# EAGLE design placa_teste_av (EAGLE 9.0.0)
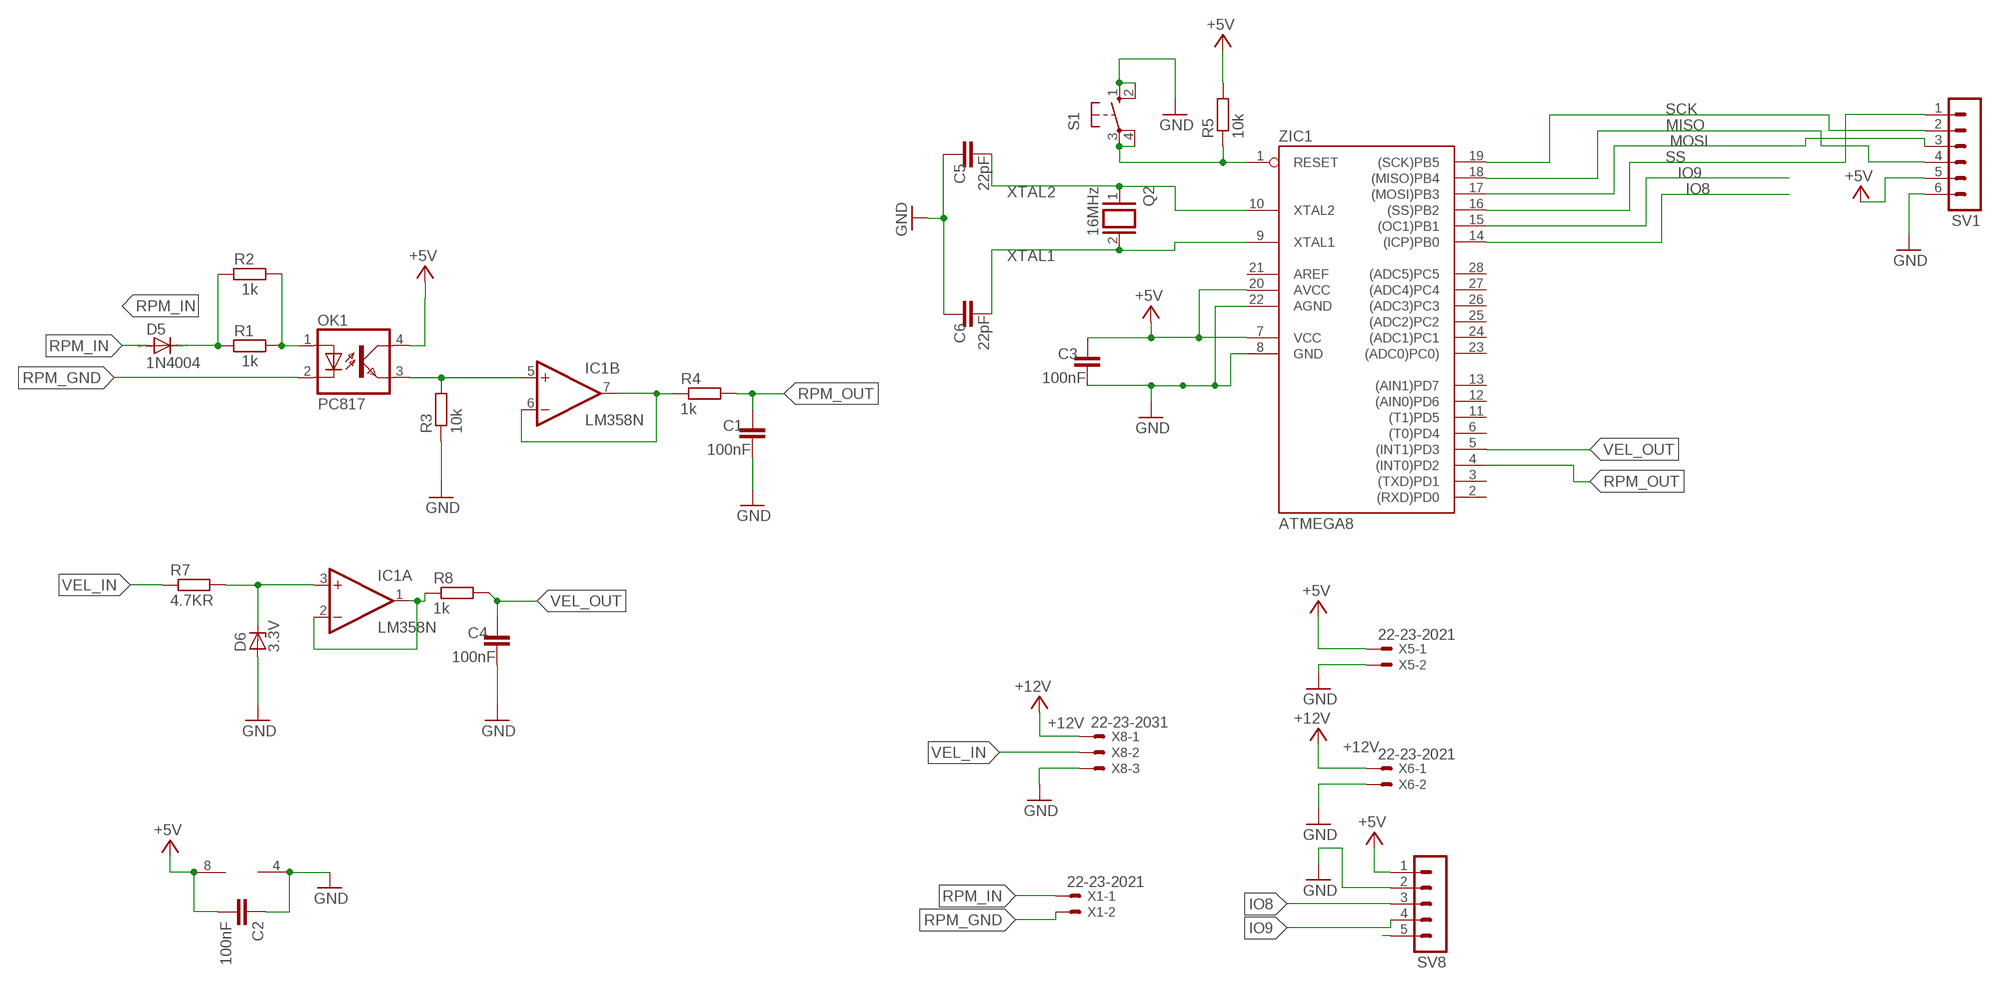
[diagram p0: schematic, sheet 1]

## Parts
C1  100nF  C5/2.5  [C5B2.5]
C2  100nF  C2,5-3  [C2.5-3]
C3  100nF  C5/2.5  [C5B2.5]
C4  100nF  C5/2.5  [C5B2.5]
C5  22pF  C5/2.5  [C5B2.5]
C6  22pF  C5/2.5  [C5B2.5]
D5  1N4004  [DO41-10]
D6  3.3V  ZENER-DIODEDO34-7  [DO34Z7]
IC1  LM358N  [DIL08]
OK1  PC817  [DIL04]
Q2  16MHz  XTAL/S  [QS]
R1  1k  R-EU_0207/7  [0207/7]
R2  1k  R-EU_0207/7  [0207/7]
R3  10k  R-EU_0207/7  [0207/7]
R4  1k  R-EU_0207/7  [0207/7]
R5  10k  R-EU_0207/7  [0207/7]
R7  4.7KR  R-EU_0207/7  [0207/7]
R8  1k  R-EU_0207/7  [0207/7]
S1  10-XX  [B3F-10XX]
SV1  MA06-1  [MA06-1]
SV8  MA05-1  [MA05-1]
X1  22-23-2021  [22-23-2021]
X5  22-23-2021  [22-23-2021]
X6  22-23-2021  [22-23-2021]
X8  22-23-2031  [22-23-2031]
ZIC1  ATMEGA8  AT90S4433P  [DIL28-3]

## Nets
+5V: C2.2 C3.2 IC1.8(P:V+) OK1.4(COL) R5.2 SV1.5 SV8.1 X5.1 ZIC1.7(VCC) ZIC1.20(AVCC)
+12V: X6.1 X8.1
GND: C1.1 C2.1 C3.1 C4.1 C5.2 C6.2 D6.A IC1.4(P:V-) R3.1 S1.1(S) S1.2(S1) SV1.6 SV8.2 X5.2 X6.2 X8.3 ZIC1.8(GND) ZIC1.22(AGND)
IO8: SV8.3 ZIC1.14((ICP)PB0)
IO9: SV8.4 ZIC1.15((OC1)PB1)
MISO: SV1.4 ZIC1.18((MISO)PB4)
MOSI: SV1.3 ZIC1.17((MOSI)PB3)
N$1: OK1.1(A) R1.2 R2.2
N$2: D5.C R1.1 R2.1
N$4: IC1.6(B:-IN) IC1.7(B:OUT) R4.1
N$6: SV8.5
N$7: IC1.5(B:+IN) OK1.3(EMIT) R3.2
N$8: D6.C IC1.3(A:+IN) R7.2
N$9: R5.1 S1.3(P) S1.4(P1) ZIC1.1(RESET)
PA10: IC1.1(A:OUT) IC1.2(A:-IN) R8.1
RPM_GND: OK1.2(C) X1.2
RPM_IN: D5.A X1.1
RPM_OUT: C1.2 R4.2 ZIC1.4((INT0)PD2)
SCK: SV1.2 ZIC1.19((SCK)PB5)
SS: SV1.1 ZIC1.16((SS)PB2)
VEL_IN: R7.1 X8.2
VEL_OUT: C4.2 R8.2 ZIC1.5((INT1)PD3)
XTAL1: C6.1 Q2.2 ZIC1.9(XTAL1)
XTAL2: C5.1 Q2.1 ZIC1.10(XTAL2)
Unconnected: ZIC1.2((RXD)PD0) ZIC1.3((TXD)PD1) ZIC1.6((T0)PD4) ZIC1.11((T1)PD5) ZIC1.12((AIN0)PD6) ZIC1.13((AIN1)PD7) ZIC1.21(AREF) ZIC1.23((ADC0)PC0)) ZIC1.24((ADC1)PC1) ZIC1.25((ADC2)PC2) ZIC1.26((ADC3)PC3) ZIC1.27((ADC4)PC4) ZIC1.28((ADC5)PC5)

## Library data of the parts
C1-C6 = capacitor-wima:C: CAPACITOR naming: grid - package width
D5 = diode:1N4004: DIODE general purpose rectifier, 1 A
D6 = diode:ZENER-DIODE: Z-Diode
IC1 = linear3:LM358: OP AMP
OK1 = optocoupler:PC817: SHARP OPTO COUPLER; MPN: PC817X4J000F; OC_FARNELL: 9707727; OC_NEWARK: 97K7059
Q2 = special:XTAL/S: CRYSTAL
R1-R5 R7 R8 = resistor:R-EU_: RESISTOR, European symbol
S1 = switch-omron:10-XX: OMRON SWITCH; MPN: B3F-1000; OC_FARNELL: 176432; OC_NEWARK: 36M3542
SV1 = con-lstb:MA06-1: PIN HEADER; OC_FARNELL: unknown; OC_NEWARK: unknown
SV8 = con-lstb:MA05-1: PIN HEADER; OC_FARNELL: unknown; OC_NEWARK: unknown
X1 X5 X6 = con-molex:22-23-2021: .100" (2.54mm) Center Header - 2 Pin; MF: MOLEX; MPN: 22-23-2021; OC_FARNELL: 1462926; OC_NEWARK: 25C3832
X8 = con-molex:22-23-2031: .100" (2.54mm) Center Header - 3 Pin; MF: MOLEX; MPN: 22-23-2031; OC_FARNELL: 1462950; OC_NEWARK: 30C0862
ZIC1 = atmel:AT90S4433: MICROCONTROLLER 4 Kbytes FLASH 128 bytes SRAM 256 bytes EEPROM UART 6-channel 10 bit ADC

## Board
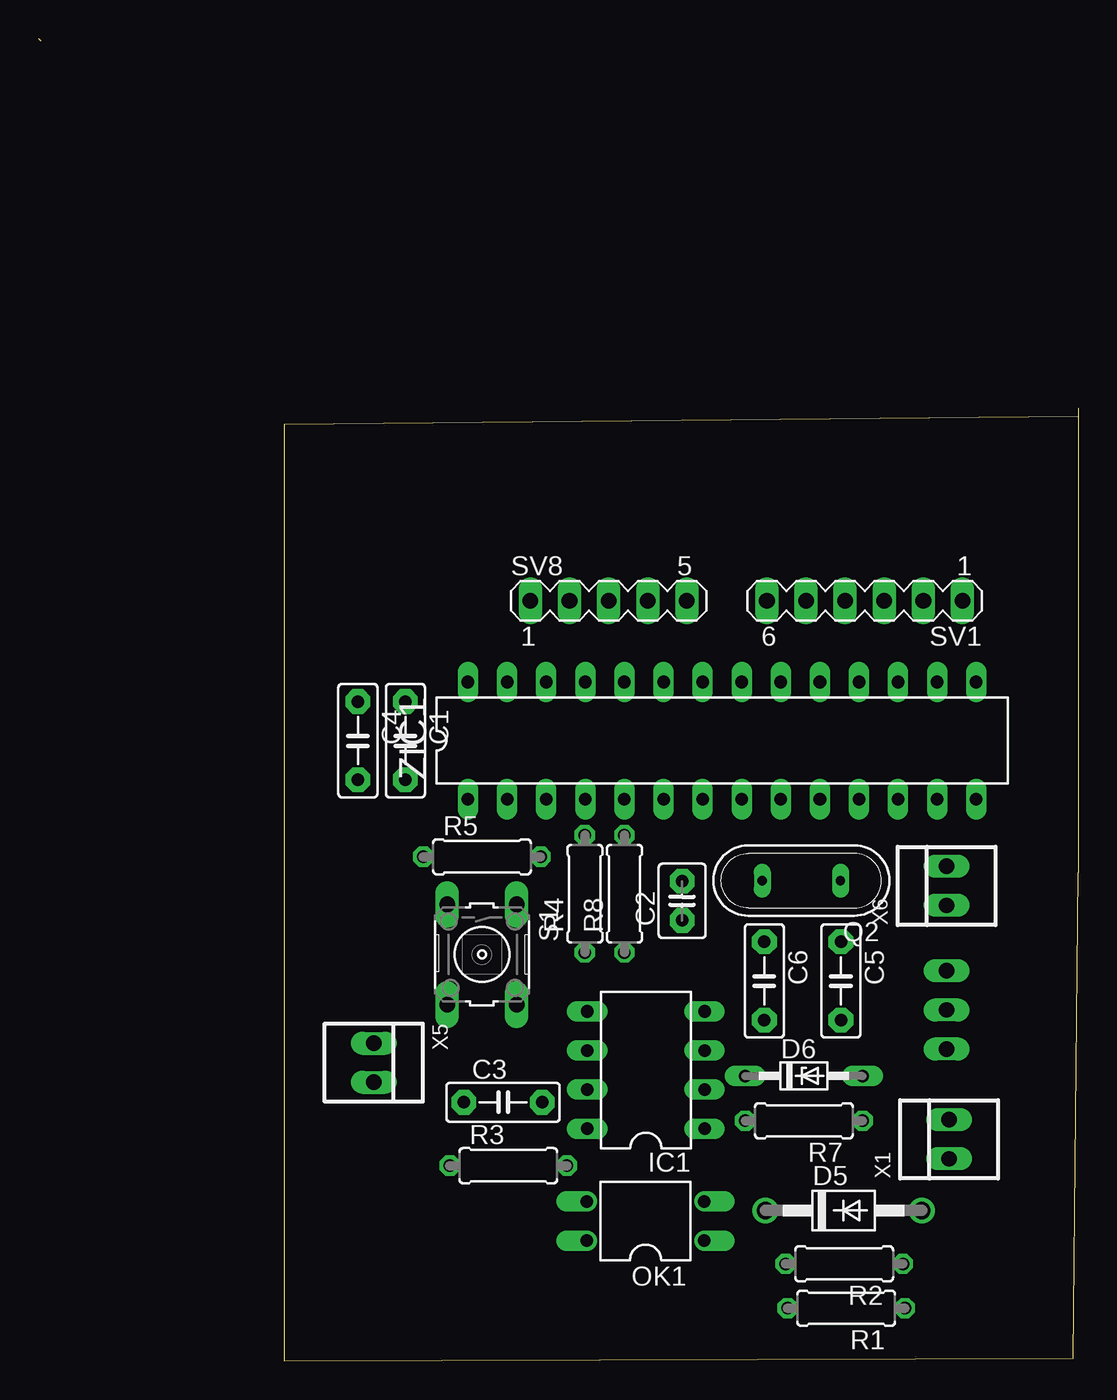
[diagram p1: board, top side]
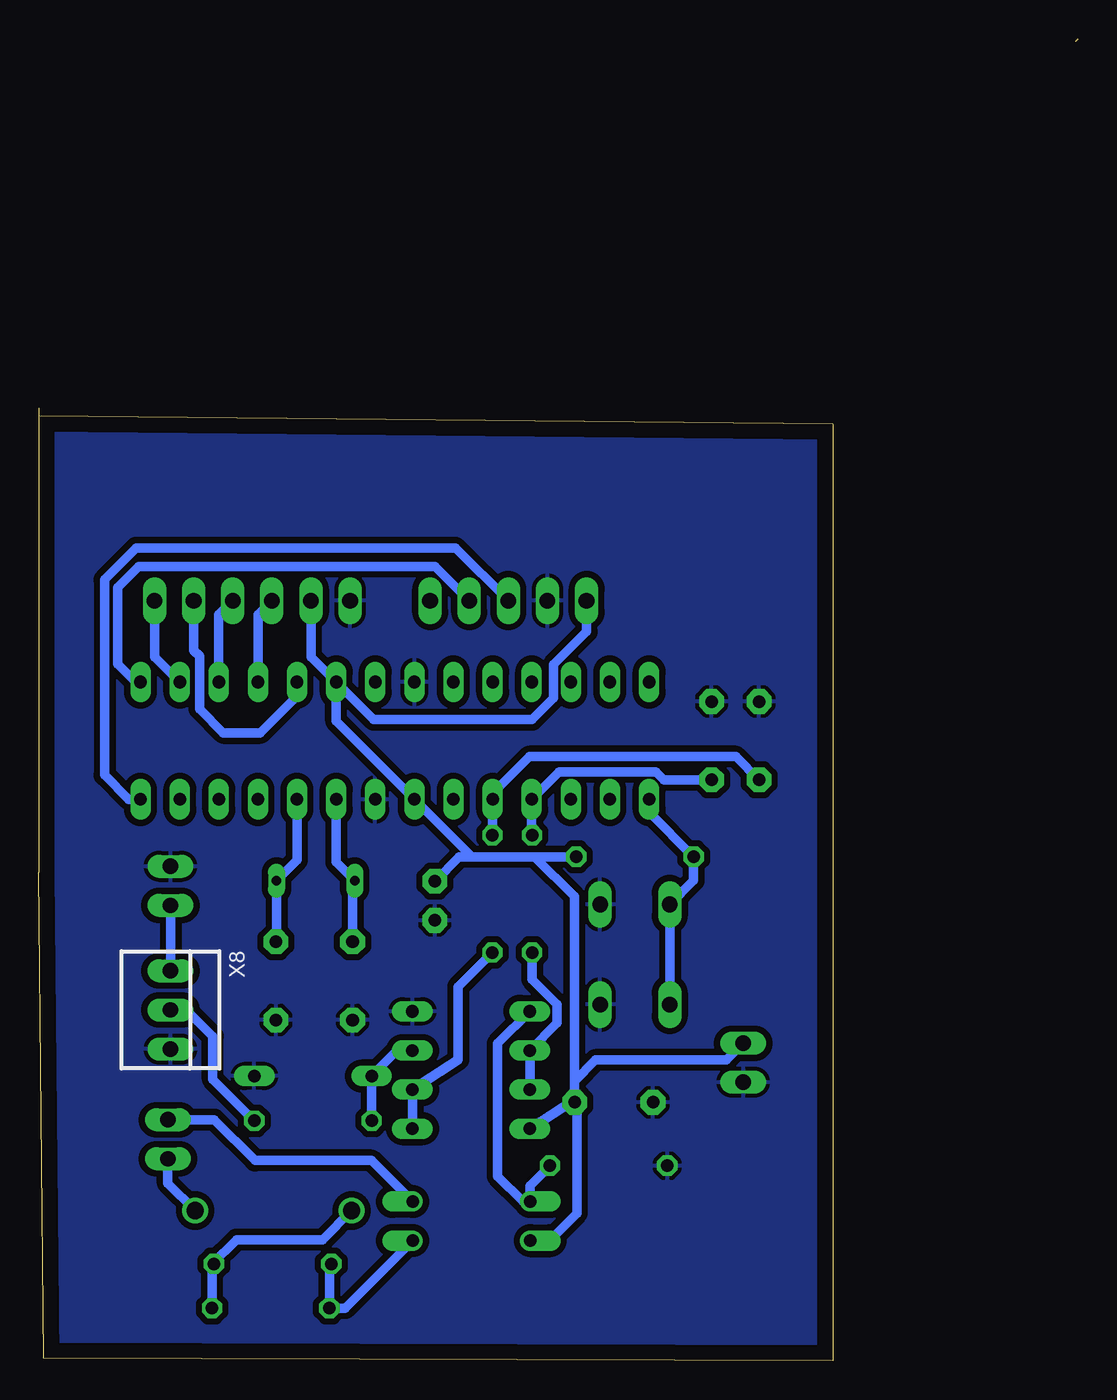
[diagram p2: board, bottom side, seen from below]

Size 67.55 x 85.9 mm. Coordinates in mm from the lower left corner, seen from the top.
Outline: 67.55,61.38 15.95,60.87 15.95,0 67.21,0.17 67.55,31.72 67.55,61.38
Outline: 67.55,61.89 67.55,61.38
Outline: 0.17,85.73 0,85.9
Copper layers (1*16): Top 0.035mm / dielectric 1.5mm / Bottom 0.035mm
Design rules "default": minimum track width 6mil, minimum drill 0.35mm, track to track 6mil, track to pad 6mil, pad to pad 6mil, via to via 6mil, smd to smd 6mil, copper to edge 40mil, drill to drill 6mil, minimum pad ring 10mil, minimum via ring 8mil, stop-mask expansion 4mil, vias tented up to drill 0mil, thermal gap 10mil

### Footprints (pad centres in the part's own frame; a part is rotated, then mirrored left to right if it is on the bottom)
C5B2.5 = drill 0.813 pad 1.6 octagon: 1 -2.54,0; 2 2.54,0
C2.5-3 = drill 0.813 pad 1.6 octagon: 1 -1.27,0; 2 1.27,0
DO41-10 = drill 1.118: A 5.08,0; C -5.08,0
DO34Z7 = drill 0.813 long: A 3.81,0; C -3.81,0
DIL08 = drill 0.813 long: 1 -3.81,-3.81; 2 -1.27,-3.81; 3 1.27,-3.81; 4 3.81,-3.81; 5 3.81,3.81; 6 1.27,3.81; 7 -1.27,3.81; 8 -3.81,3.81
DIL04 = drill 0.813 offset: 1 -1.27,-3.81; 2 1.27,-3.81; 3 1.27,3.81; 4 -1.27,3.81
QS = drill 0.61 long: 1 -2.54,0; 2 2.54,0
0207/7 = drill 0.813 octagon: 1 -3.81,0; 2 3.81,0
B3F-10XX = drill 1.016 long: 1 -3.251,2.261; 2 3.251,2.261; 3 -3.251,-2.261; 4 3.251,-2.261
MA06-1 = drill 1.016 long: 1 -6.35,0; 2 -3.81,0; 3 -1.27,0; 4 1.27,0; 5 3.81,0; 6 6.35,0
MA05-1 = drill 1.016 long: 1 -5.08,0; 2 -2.54,0; 3 0,0; 4 2.54,0; 5 5.08,0
22-23-2021 = drill 1 long: 1 -1.27,0; 2 1.27,0
22-23-2031 = drill 1 long: 1 -2.54,0; 2 0,0; 3 2.54,0
DIL28-3 = drill 0.813 long: 1 -16.51,-3.81; 2 -13.97,-3.81; 3 -11.43,-3.81; 4 -8.89,-3.81; 5 -6.35,-3.81; 6 -3.81,-3.81; 7 -1.27,-3.81; 8 1.27,-3.81; 9 3.81,-3.81; 10 6.35,-3.81; 11 8.89,-3.81; 12 11.43,-3.81; 13 13.97,-3.81; 14 16.51,-3.81; 15 16.51,3.81; 16 13.97,3.81; 17 11.43,3.81; 18 8.89,3.81; 19 6.35,3.81; 20 3.81,3.81; 21 1.27,3.81; 22 -1.27,3.81; 23 -3.81,3.81; 24 -6.35,3.81; 25 -8.89,3.81; 26 -11.43,3.81; 27 -13.97,3.81; 28 -16.51,3.81

### Placement (x,y rotation side)
C1  23.83,40.29 270 top
C2  41.81,29.89 90 top
C3  30.18,16.8 0 top
C4  20.75,40.29 270 top
C5  52.12,24.69 270 top
C6  47.15,24.69 270 top
D5  52.29,9.77 0 top
D6  49.72,18.52 0 top
IC1  39.45,18.9 90 top
OK1  39.43,9.09 90 top
Q2  49.55,31.2 180 top
R1  52.46,3.43 180 top
R2  52.34,6.31 180 top
R3  30.52,12.69 0 top
R4  35.49,30.35 90 top
R5  28.8,32.75 0 top
R7  49.72,15.6 180 top
R8  38.06,30.35 90 top
S1  28.8,26.4 270 top
SV1  53.66,49.38 180 top
SV8  37.03,49.38 0 top
X1  59.15,14.4 90 top
X5  21.77,19.37 270 top
X6  58.98,30.86 90 top
X8  58.98,22.8 270 bottom
ZIC1  44.41,40.29 0 top

### Tracks (layer width: path | path; a pad name or v marks a point on that pad's centre or on a via)
+5V
  Bottom 0.61: R5.2 35.32,32.75 | 39.4,32.75 ZIC1.7 48.22,41.56 ZIC1.20 | IC1.8 32.75,16.95 | 32.75,16.95 32.75,17.49 | 32.75,17.49 32.75,18.17 | 32.75,18.17 32.75,30.18 35.32,32.75 | 35.32,32.75 39.4,32.75 | OK1.4 34.36,7.82 32.58,9.6 32.58,16.66 | 32.58,16.66 32.58,16.78 32.75,16.95 | C3.2 32.58,16.66 | C3.2 32.75,16.83 32.75,16.95 | C3.2 32.72,17.46 32.75,17.49 | 39.4,32.75 40.22,32.75 C2.2 | ZIC1.20 45.78,41.66 35.49,41.66 34.09,43.06 34.09,45.22 31.95,47.36 SV8.1 | ZIC1.20 49.85,45.74 SV1.5 | X5.1 22.87,19.55 31.38,19.55 32.75,18.17
+12V
  Bottom 0.61: X6.1 X8.1
GND
  pour Bottom (isolate 0.406): 67.55,61.38 67.72,54.35 67.38,0.34 18.17,0.34 15.77,0.51 15.77,61.21
IO8
  Bottom 0.61: SV8.3 40.46,52.81 61.21,52.81 63.27,50.75 63.27,38.06 61.68,36.48 ZIC1.14
IO9
  Bottom 0.61: SV8.4 41.8,51.61 61.04,51.61 62.41,50.24 62.41,45.26 61.25,44.1 ZIC1.15
MISO
  Bottom 0.61: SV1.4 53.3,48.48 ZIC1.18
MOSI
  Bottom 0.61: SV1.3 55.84,48.48 ZIC1.17
N$1
  Bottom 0.61: R2.2 48.65,6.19 R1.2 47.63,3.43 OK1.1
N$2
  Bottom 0.61: R1.1 56.27,6.19 | 56.27,6.19 R2.1 | D5.C 49.1,7.89 54.69,7.89 56.27,6.31 56.27,6.19
N$4
  Bottom 0.61: IC1.7 IC1.6 33.86,21.95 33.86,23.17 35.49,24.8 R4.1
N$7
  Bottom 0.61: IC1.5 37.72,20.63 37.72,12 36.07,10.36 OK1.3 35.62,11.39 R3.2
N$8
  Bottom 0.61: IC1.3 44.26,20.17 D6.C R7.2
N$9
  Bottom 0.61: S1.4 S1.3 24.99,31.2 R5.1 27.9,35.65 ZIC1.1
PA10
  Bottom 0.61: R8.1 40.29,24.31 40.29,19.57 IC1.2 IC1.1
RPM_GND
  Bottom 0.61: OK1.2 45.92,13.03 53.49,13.03 56.13,15.67 X1.2
RPM_IN
  Bottom 0.61: D5.A 59.15,11.55 X1.1
RPM_OUT
  Bottom 0.61: R4.2 35.52,34.18 ZIC1.4 33.74,38.26 27.43,38.26 26.93,37.75 C1.2
SCK
  Bottom 0.61: SV1.2 57.47,46.16 57.09,45.78 57.09,42.35 55.55,40.81 53.15,40.81 50.76,43.2 ZIC1.19
SS
  Bottom 0.61: SV1.1 60.01,45.74 ZIC1.16
VEL_IN
  Bottom 0.61: R7.1 56.24,18.31 56.24,21.09 57.95,22.8 X8.2
VEL_OUT
  Bottom 0.61: R8.2 ZIC1.5 38.06,36.87 35.66,39.26 22.26,39.26 C4.2
XTAL1
  Bottom 0.61: ZIC1.9 48.22,32.41 Q2.2 47.15,31.06 C6.1
XTAL2
  Bottom 0.61: ZIC1.10 50.76,32.54 Q2.1 52.09,27.26 C5.1